# EasyEDA schematic 6502.json
TITLE: 6502 with serial interface; REV: 4; Date: 2023-06-30; Sheet: 1/1; Drawn By: emersonmde
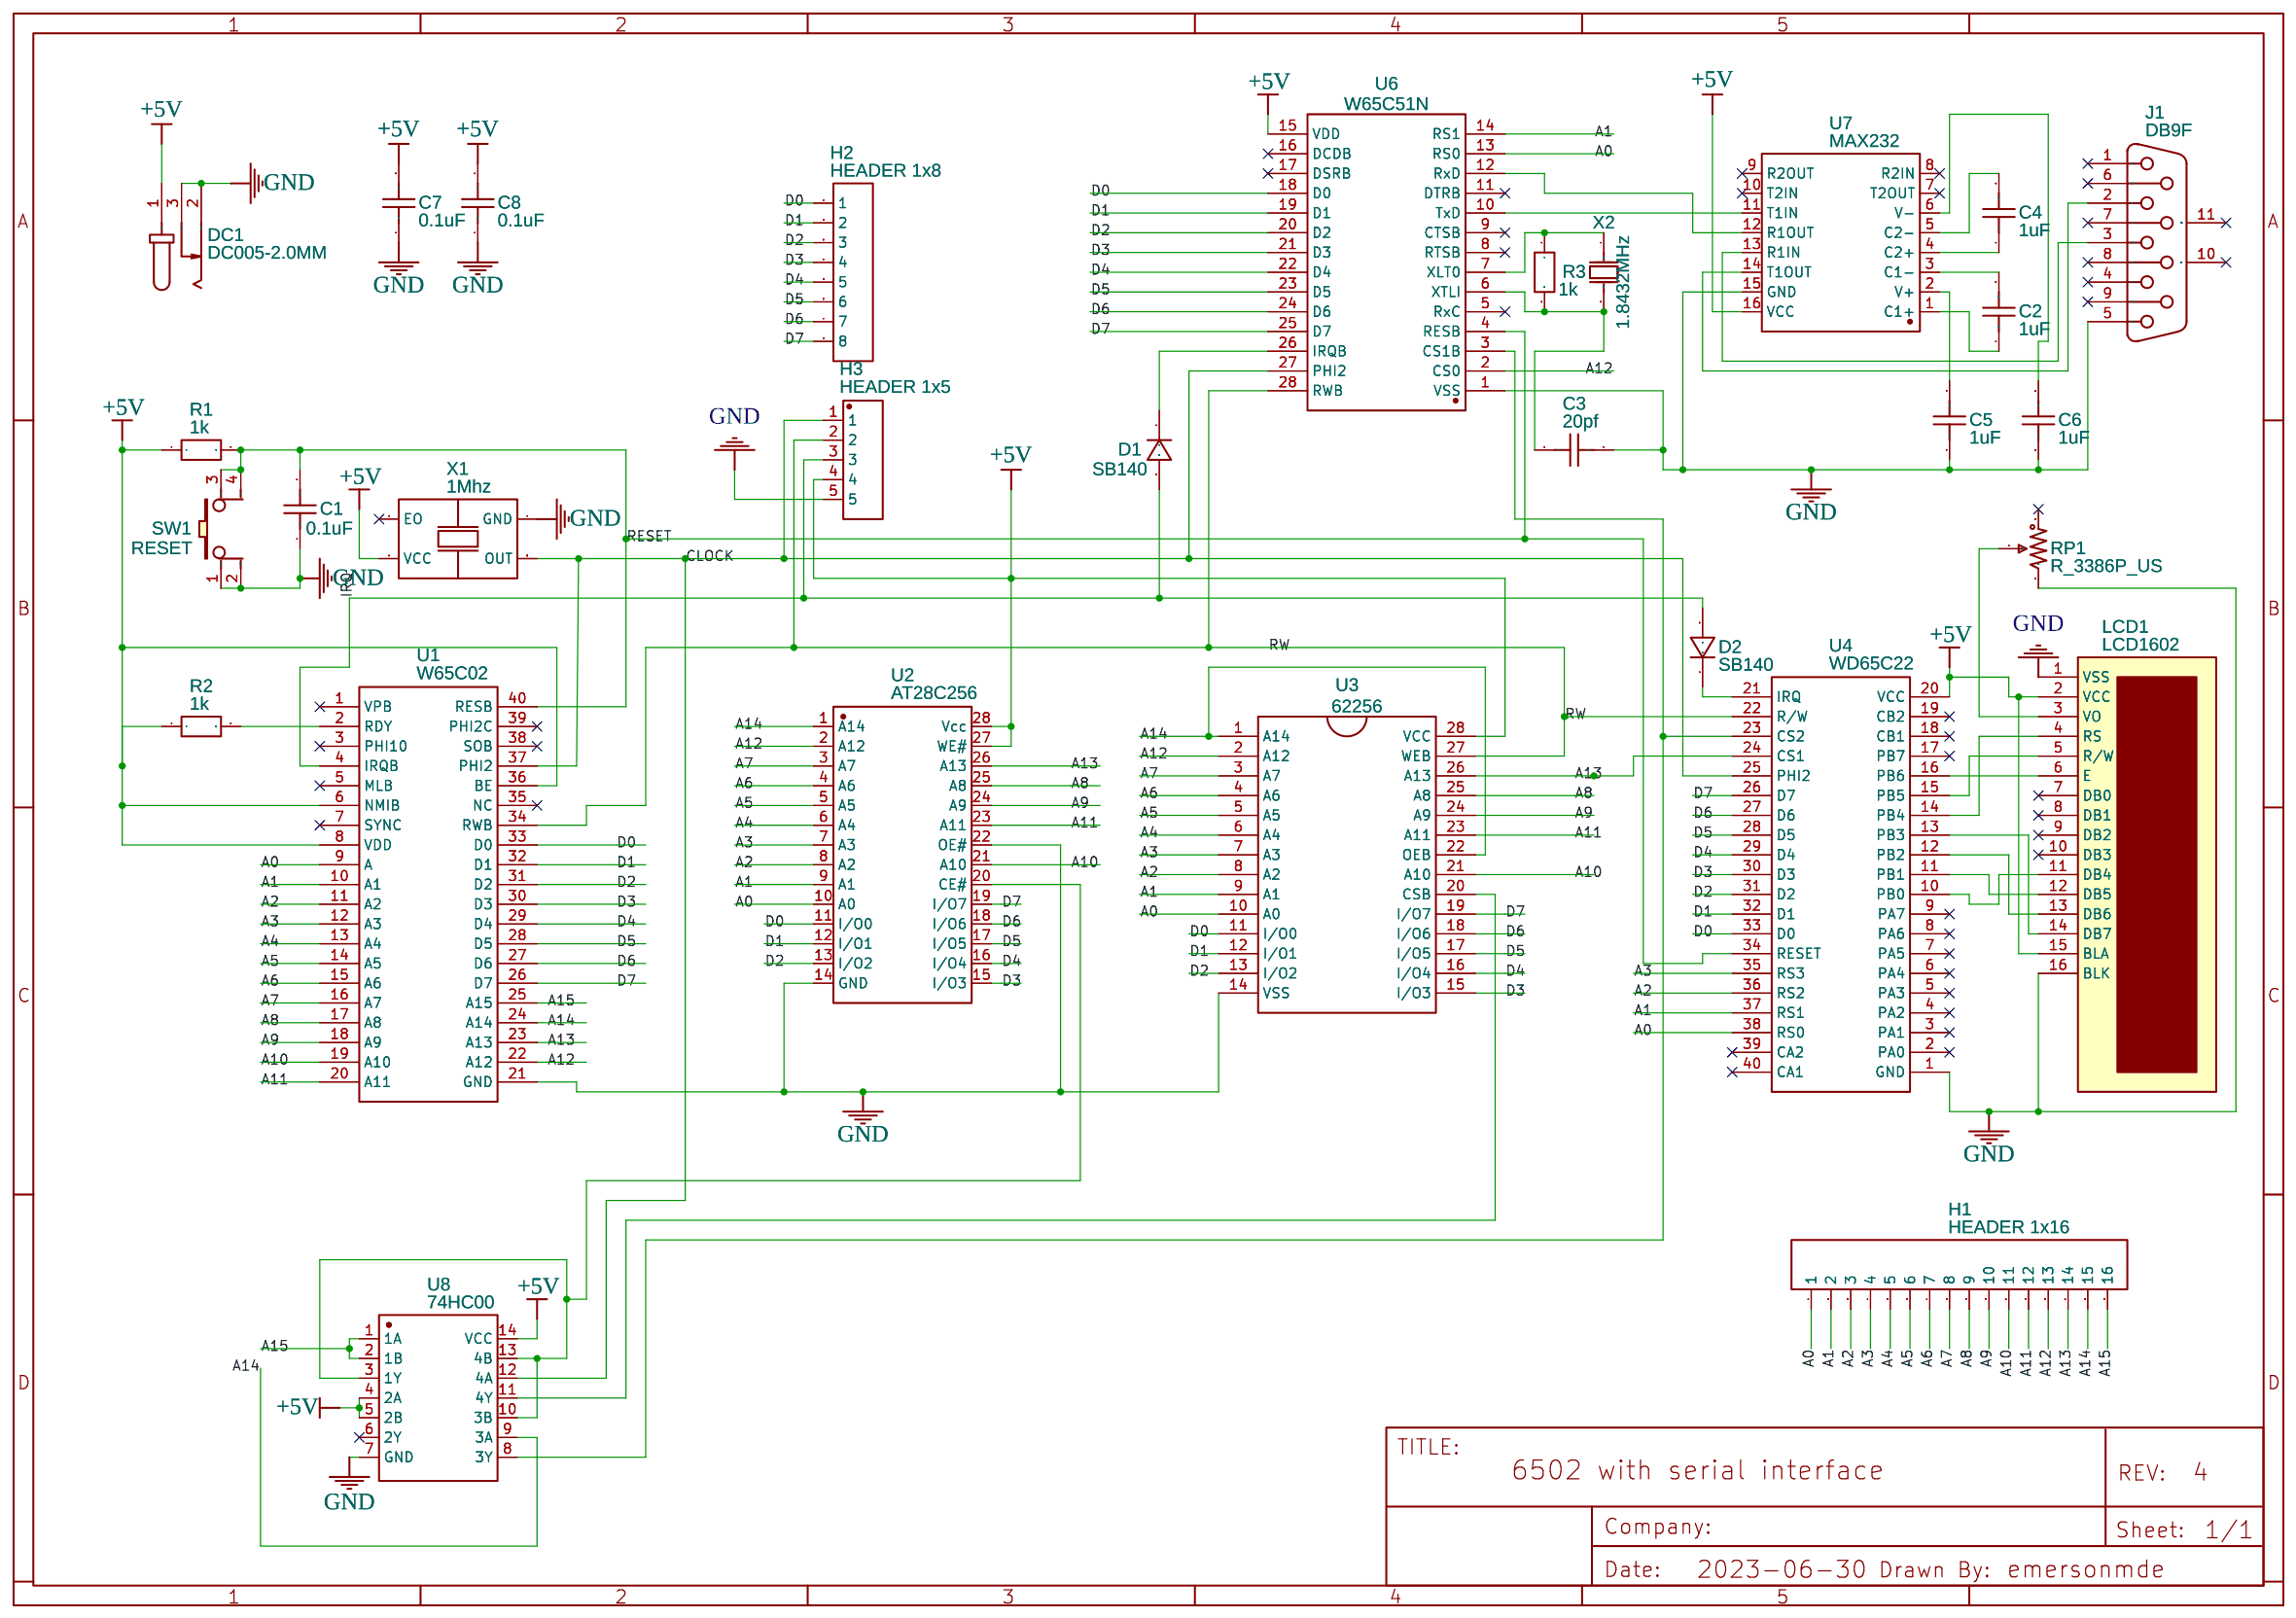
[diagram p0: schematic sheet]

## Parts
C1  0.1uF  [C0603]
C2  1uF  [C0603]
C3  20pf  [C0603]
C4  1uF  [C0603]
C5  1uF  [C0603]
C6  1uF  [C0603]
C7  0.1uF  [C0603]
C8  0.1uF  [C0603]
D1  SB140  [SOD-123_L2.8-W1.8-LS3.7-RD]
D2  SB140  [SOD-123_L2.8-W1.8-LS3.7-RD]
DC1  DC005-2.0MM  [DC-IN-TH_DC005]
H1  HEADER 1x16  [HDR-TH_16P-P2.54-V-F-1]
H2  HEADER 1x8  [HDR-TH_8P-P2.54-V-F-1]
H3  HEADER 1x5  [HEADER-HEADER-FEMALE-2.54_1X5]
J1  DB9F  [DB9-TH_DB9F_C9900018961]
LCD1  LCD1602  [LCD1602]
R1  1k  [R0603]
R2  1k  [R0603]
R3  1k  [R0603]
RP1  R_3386P_US  [RES-ADJ-TH_3386P]
SW1  RESET  [KEY-TH_4P-L6.0-W6.0-P4.50]
U1  W65C02  [W65C02]
U2  AT28C256  [PDIP-28_L37.0-W13.5-P2.54-LS15.6-BL]
U3  62256  [HM62256B]
U4  WD65C22  [DIP-40_L52.0-W13.7-P2.54-LS15.2-BL]
U6  W65C51N  [DIP-28_L37.0-W13.8-P2.54-LS15.8-BL]
U7  MAX232  [PDIP-16_L19.7-W6.6-P2.54-LS7.6-BL]
U8  74HC00  [DIP-14_L20.0-W7.6-P2.54-LS7.6-BL]
X1  1Mhz  [FULL CAN OSCILLATOR CRYSTAL]
X2  1.8432MHz  [OSC-TH_L10.0-W4.5-P5.00]

## Library data of the parts
C1-C8 = C_0603_US: Contributor: LCEDA_Lib
D1 D2 = 1N4007W: Supplier: LCSC; Supplier Part: C328592; Manufacturer: BLUE ROCKET; Contributor: LCEDA_Lib
DC1 = DC005-2.0MM: Supplier: LCSC; Manufacturer: SOFNG; Supplier Part: C111567
H1 = Header-Female-2.54_1x16: Supplier: LCSC; Manufacturer: BOOMELE(博穆精密); Manufacturer Part: 2.54-1*16P母; Supplier Part: C66987; JLCPCB Part Class: Extended Part
H2 = Header-Female-2.54_1x8: Supplier: LCSC; Manufacturer: BOOMELE(博穆精密); Manufacturer Part: 2.54-1*8P母环保; Supplier Part: C27438; JLCPCB Part Class: Extended Part
H3 = HEADER - 2.54_1X5: Contributor: mILLrAT
J1 = DB9F: Supplier: LCSC; Supplier Part: C9900018961; Manufacturer: null; JLCPCB Part Class: Extended Part; Contributor: lcsc
LCD1 = LCD1602: Manufacturer: LONTECH(厦门龙特); Manufacturer Part: LCM1602K-NSW-BBW; Supplier Part: C83275; Supplier: LCSC; Contributor: AlessandroMelillo; Package Display: No
R1-R3 = R_0603_EU: Contributor: LCEDA_Lib
RP1 = R_3386P_US: Supplier: LCSC; Contributor: LCEDA_Lib; value(Ω): 10K
SW1 = button6*6*8.5: Supplier Part: C59980; Supplier: LCSC; Manufacturer: ReliaPro; JLCPCB Part Class: Extended Part
U1 = W65C02: Contributor: victorfumeirosenqvist
U2 = AT28C256-15DM/883-815: Supplier: LCSC; Supplier Part: C612358; Manufacturer: MICROCHIP(美国微芯); link: https://atta.szlcsc.comnull; Contributor: lcsc
U3 = HM62256B: Contributor: rainningtacos1
U4 = WD65C22: Contributor: 21schemerhornn
U6 = W65C51N6TPG-14: Manufacturer: Western Design Center; Supplier: Digi-Key; Supplier Part: 955-W65C51N6TPG-14; link: https://www.mouser.com/datasheet/2/436/WDC_Datasheet%20Update_20141024-1211725.pdf; Contributor: jasonquaylecannon
U7 = MAX232AEPE+: Supplier: LCSC; Supplier Part: C242610; Manufacturer: ADI(亚德诺)/MAXIM(美信); Contributor: lcsc
U8 = SN74HC00N: Supplier: LCSC; Manufacturer: TI(德州仪器); Supplier Part: C2902; JLCPCB Part Class: Extended Part
X1 = Full Can Oscillator Crystal: Manufacturer: CTS-Frequency Controls; Manufacturer Part: MXO45-3C-7M372800; Supplier: Digi-Key; Supplier Part: 110-MXO45-3C-7M372800-ND; Contributor: carlos14
X2 = X49UD18432MSD2SC-1 COPY: Supplier: LCSC; Manufacturer: YXC; Manufacturer Part: X49UD18432MSD2SC-1; Supplier Part: C2179

## Nets
+5V: C7.2 C8.2 DC1.1 H3.4 LCD1.2(VCC) LCD1.15(BLA) R1.1 R2.1 U1.6(NMIB) U1.8(VDD) U1.36(BE) U2.27(WE#) U2.28(Vcc) U3.28(VCC) U4.20(VCC) U6.15(VDD) U7.16(VCC) U8.4(2A) U8.5(2B) U8.14(VCC) X1.14(VCC)
GND: C1.1 C3.1 C5.1 C6.1 C7.1 C8.1 DC1.2 DC1.3 H3.5 J1.5 LCD1.1(VSS) LCD1.16(BLK) RP1.3 SW1.1 SW1.2 U1.21(GND) U2.14(GND) U2.22(OE#) U3.14(VSS) U4.1(GND) U6.1(VSS) U7.15(GND) U8.7(GND) X1.7(GND)
A0: H1.1 U1.9(A) U2.10(A0) U3.10(A0) U4.38(RS0) U6.13(RS0)
A1: H1.2 U1.10(A1) U2.9(A1) U3.9(A1) U4.37(RS1) U6.14(RS1)
A2: H1.3 U1.11(A2) U2.8(A2) U3.8(A2) U4.36(RS2)
A3: H1.4 U1.12(A3) U2.7(A3) U3.7(A3) U4.35(RS3)
A4: H1.5 U1.13(A4) U2.6(A4) U3.6(A4)
A5: H1.6 U1.14(A5) U2.5(A5) U3.5(A5)
A6: H1.7 U1.15(A6) U2.4(A6) U3.4(A6)
A7: H1.8 U1.16(A7) U2.3(A7) U3.3(A7)
A8: H1.9 U1.17(A8) U2.25(A8) U3.25(A8)
A9: H1.10 U1.18(A9) U2.24(A9) U3.24(A9)
A10: H1.11 U1.19(A10) U2.21(A10) U3.21(A10)
A11: H1.12 U1.20(A11) U2.23(A11) U3.23(A11)
A12: H1.13 U1.22(A12) U2.2(A12) U3.2(A12) U6.2(CS0)
A13: H1.14 U1.23(A13) U2.26(A13) U3.26(A13) U4.24(CS1)
A14: H1.15 U1.24(A14) U2.1(A14) U3.1(A14) U3.22(OEB) U8.9(3A)
A15: H1.16 U1.25(A15) U8.1(1A) U8.2(1B)
CLOCK: H3.1 U1.37(PHI2) U4.25(PHI2) U6.27(PHI2) U8.12(4A) X1.8(OUT)
D0: H2.1 U1.33(D0) U2.11(I/O0) U3.11(I/O0) U4.33(D0) U6.18(D0)
D1: H2.2 U1.32(D1) U2.12(I/O1) U3.12(I/O1) U4.32(D1) U6.19(D1)
D2: H2.3 U1.31(D2) U2.13(I/O2) U3.13(I/O2) U4.31(D2) U6.20(D2)
D3: H2.4 U1.30(D3) U2.15(I/O3) U3.15(I/O3) U4.30(D3) U6.21(D3)
D4: H2.5 U1.29(D4) U2.16(I/O4) U3.16(I/O4) U4.29(D4) U6.22(D4)
D5: H2.6 U1.28(D5) U2.17(I/O5) U3.17(I/O5) U4.28(D5) U6.23(D5)
D6: H2.7 U1.27(D6) U2.18(I/O6) U3.18(I/O6) U4.27(D6) U6.24(D6)
D7: H2.8 U1.26(D7) U2.19(I/O7) U3.19(I/O7) U4.26(D7) U6.25(D7)
IRQ: D1.2 D2.2 H3.3 U1.4(IRQB)
RESET: C1.2 R1.2 SW1.3 SW1.4 U1.40(RESB) U4.34(RESET) U6.4(RESB)
RW: H3.2 U1.34(RWB) U3.27(WEB) U4.22(R/W) U6.28(RWB)
Net-(C2-1): C2.1 U7.1(C1+)
Net-(C2-2): C2.2 U7.3(C1-)
Net-(C3-2): C3.2 R3.2 U6.6(XTLI) X2.2(OSC2)
Net-(C4-1): C4.1 U7.4(C2+)
Net-(C4-2): C4.2 U7.5(C2-)
Net-(C5-2): C5.2 U7.2(V+)
Net-(C6-2): C6.2 U7.6(V-)
Net-(D1-1): D1.1 U6.26(IRQB)
Net-(D2-1): D2.1 U4.21(IRQ)
Net-(J1-2): J1.2 U7.14(T1OUT)
Net-(J1-3): J1.3 U7.13(R1IN)
Net-(LCD1-3): LCD1.3(VO) RP1.2
Net-(LCD1-4): LCD1.4(RS) U4.14(PB4)
Net-(LCD1-5): LCD1.5(R/W) U4.15(PB5)
Net-(LCD1-6): LCD1.6(E) U4.16(PB6)
Net-(LCD1-11): LCD1.11(DB4) U4.10(PB0)
Net-(LCD1-12): LCD1.12(DB5) U4.11(PB1)
Net-(LCD1-13): LCD1.13(DB6) U4.12(PB2)
Net-(LCD1-14): LCD1.14(DB7) U4.13(PB3)
Net-(R2-2): R2.2 U1.2(RDY)
Net-(R3-1): R3.1 U6.7(XLT0) X2.1(OSC1)
Net-(U2-20): U2.20(CE#) U8.3(1Y) U8.10(3B) U8.13(4B)
Net-(U3-20): U3.20(CSB) U8.11(4Y)
Net-(U4-23): U4.23(CS2) U6.3(CS1B) U8.8(3Y)
Net-(U6-10): U6.10(TxD) U7.11(T1IN)
Net-(U6-12): U6.12(RxD) U7.12(R1OUT)

Not connected (* = marked no-connect by the designer): J1 1* 4* 6* 7* 8* 9* 10(MH1)* 11(MH2)*; LCD1 7(DB0)* 8(DB1)* 9(DB2)* 10(DB3)*; RP1 1*; U1 1(VPB)* 3(PHI10)* 5(MLB)* 7(SYNC)* 35(NC)* 38(SOB)* 39(PHI2C)*; U4 2(PA0)* 3(PA1)* 4(PA2)* 5(PA3)* 6(PA4)* 7(PA5)* 8(PA6)* 9(PA7)* 17(PB7)* 18(CB1)* 19(CB2)* 39(CA2)* 40(CA1)*; U6 5(RxC)* 8(RTSB)* 9(CTSB)* 11(DTRB)* 16(DCDB)* 17(DSRB)*; U7 7(T2OUT)* 8(R2IN)* 9(R2OUT)* 10(T2IN)*; U8 6(2Y)*; X1 1(EO)*
